# EAGLE design untitled (EAGLE 6.1)
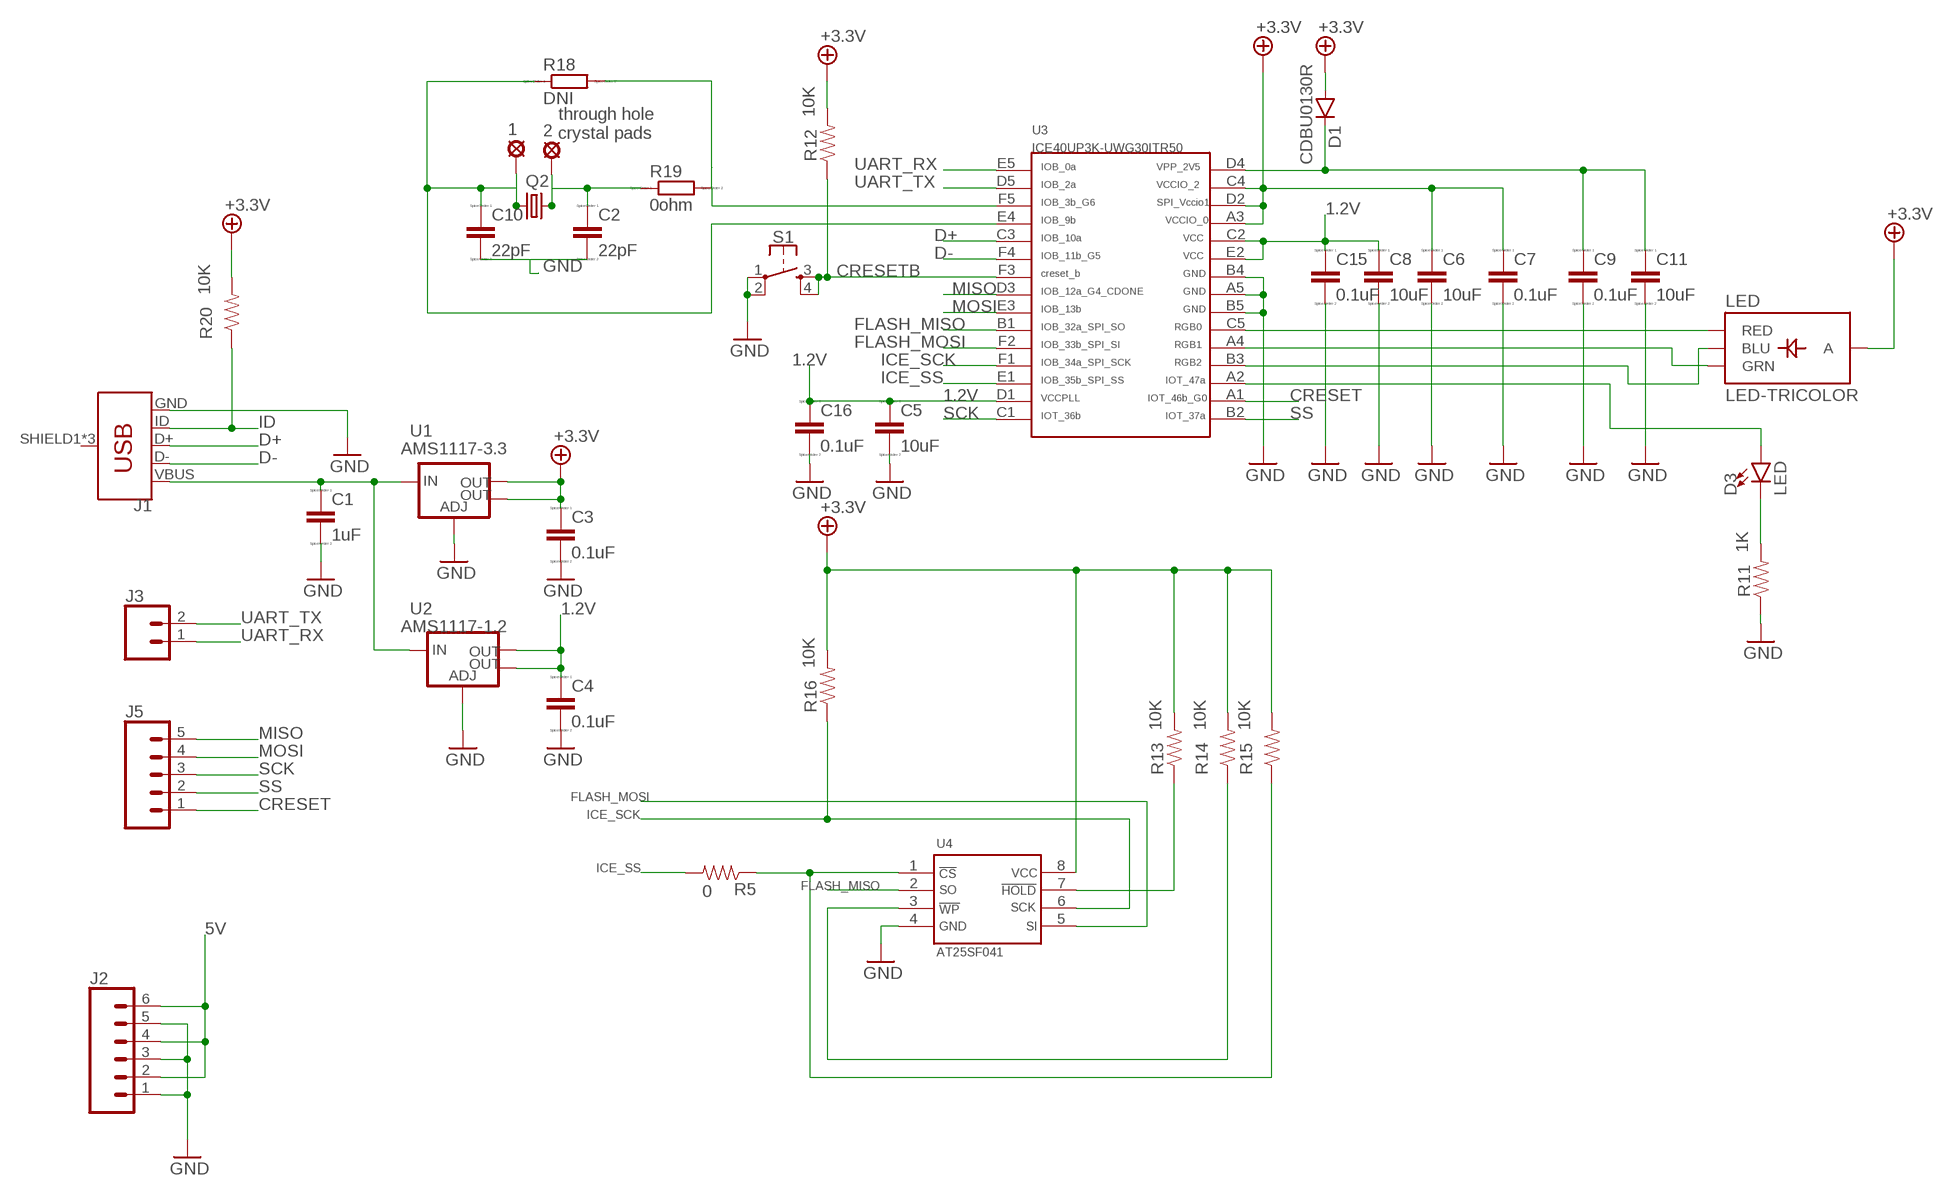
[diagram p0: schematic, sheet 1]

## Parts
1  LSP10  [LSP10]
2  LSP10  [LSP10]
C1  1uF  CC0402  [C0402]
C2  22pF  CC0402  [C0402]
C3  0.1uF  CC0402  [C0402]
C4  0.1uF  CC0402  [C0402]
C5  10uF  CC0402  [C0402]
C6  10uF  CC0402  [C0402]
C7  0.1uF  CC0402  [C0402]
C8  10uF  CC0402  [C0402]
C9  0.1uF  CC0402  [C0402]
C10  22pF  CC0402  [C0402]
C11  10uF  CC0402  [C0402]
C15  0.1uF  CC0402  [C0402]
C16  0.1uF  CC0402  [C0402]
D1  CDBU0130R  DIODE1  [SOD523]
D3  LED  LED0603  [LED-0603]
J1  USB_MICRO-B_FEMALE-SMT  [USB-B-MICRO-SMD]
J2  CONN_06NO_SILK_FEMALE_PTH  [1X06_NO_SILK]
J3  CONN_02  [1X02]
J5  CONN_05  [1X05]
LED  LED-TRICOLOR  [LED-TRICOLOR-SMD]
Q2  CRYSTALHC49UP  [HC49UP]
R5  0  RESISTOR0805-RES  [0805]
R11  1K  RESISTOR0603  [0603-RES]
R12  10K  RESISTOR0603  [0603-RES]
R13  10K  RESISTOR0603-RES  [0603-RES]
R14  10K  RESISTOR0603-RES  [0603-RES]
R15  10K  RESISTOR0603-RES  [0603-RES]
R16  10K  RESISTOR0603-RES  [0603-RES]
R18  DNI  RR0402  [R0402]
R19  0ohm  RR0402  [R0402]
R20  10K  RESISTOR0603  [0603-RES]
S1  MOMENTARY-SWITCH-SPST-2-SMD-4.6X2.8MM  [TACTILE_SWITCH_SMD_4.6X2.8MM]
U1  AMS1117-3.3  V_REG_LM1117SOT223  [SOT223]
U2  AMS1117-1.2  V_REG_LM1117SOT223  [SOT223]
U3  ICE40UP3K-UWG30ITR50  [WLSC-30]
U4  AT25SF041  [SO8]

## Nets
1.2V: C4.1 C5.1 C8.1 C15.1 C16.1 U2.2(OUT) U2.4(OUT) U3.C2 U3.D1 U3.E2
5: 1.MP C10.1 Q2.1 R18.1 U3.E4
5V: C1.1 J1.VBUS J2.2 J2.4 J2.6 U1.3(IN) U2.3(IN)
6: R18.2 R19.2 U3.F5
+3.3V: C3.1 C6.1 C7.1 D1.A LED.A R12.2 R13.2 R14.2 R15.2 R16.2 R20.2 U1.2(OUT) U1.4(OUT) U3.A3 U3.C4 U3.D2 U4.8
CRESET: J5.1 U3.A1
CRESETB: R12.1 S1.3 S1.4 U3.F3
D+: J1.D+ U3.C3
D-: J1.D- U3.F4
FLASH_MISO: U3.B1 U4.2
FLASH_MOSI: U3.F2 U4.5
GND: C1.2 C2.2 C3.2 C4.2 C5.2 C6.2 C7.2 C8.2 C9.2 C10.2 C11.2 C15.2 C16.2 J1.GND J2.1 J2.3 J2.5 R11.1 S1.1 S1.2 U1.1(ADJ) U2.1(ADJ) U3.A5 U3.B4 U3.B5 U4.4
ICE_SCK: R16.1 U3.F1 U4.6
ICE_SS: R5.2 U3.E1
ID: J1.ID R20.1
MISO: J5.5 U3.D3
MOSI: J5.4 U3.E3
N$4: R13.1 U4.7
N$6: R14.1 U4.3
N$7: R5.1 R15.1 U4.1
N$9: LED.R(RED) U3.C5
N$10: LED.G(GRN) U3.A4
N$11: LED.B(BLU) U3.B3
N$12: D3.A U3.A2
N$13: D3.C R11.2
N$18: C9.1 C11.1 D1.C U3.D4
N$24: 2.MP C2.1 Q2.2 R19.1
SCK: J5.3 U3.C1
SS: J5.2 U3.B2
UART_RX: J3.1 U3.E5
UART_TX: J3.2 U3.D5
Unconnected: J1.SHIELD1(SHIELD) J1.SHIELD2(SHIELD) J1.SHIELD3(SHIELD)

## Notes on the sheet
- through hole
   crystal pads

## Library data of the parts
1 2 = solpad:LSP10: SOLDER PAD drill 1.0 mm, distributor Buerklin, 12H555
C1-C11 C15 C16 = eagle-ltspice:C: CAPACITOR, European symbol; SPICEMODEL: NONE; SPICEPREFIX: C
D1 = CDBU0130R:DIODE1
D3 = SparkFun-LED:LED: LED (Generic) Standard schematic elements and footprints for 5mm, 3mm, 1206, and 0603 sized LEDs. Generic LEDs with no color specified.
J1 = MICRO USB 105164-0001:USB_MICRO-B: USB Type Micro-B Connector Male/female and PTH/SMT variants SparkFun Products: SparkFun microB USB Breakout <https://www.sparkfun.com/products/12035> SparkFun USB microB Plug Breakout <https://www.sparkfun.com/products/10031> SparkFun ESP8266 Thing <https://www.sparkfun.com/products/13231>; PROD_ID: CONN-11752
J2 = SparkFun-Connectors:CONN_06: Multi connection point. Often used as Generic Header-pin footprint for 0.1 inch spaced/style header connections On any of the 0.1 inch spaced packages, you can populate with these: Break Away Headers - Straight <https://www.sparkfun.com/products/116> (PRT-00116) Break Away Male Headers - Right Angle <https://www.sparkfun.com/products/553> (PRT-00553) Female Headers <https://www.sparkfun.com/products/115> (PRT-00115) Break Away Headers - Machine Pin <https://www.sparkfun.com/products/117> (PRT-00117) Break Away Female Headers - Swiss Machine Pin <https://www.sparkfun.com/products/743> (PRT-00743) Arduino Stackable Header - 6 Pin <https://www.sparkfun.com/products/9280> (PRT-09280) For SCREWTERMINALS and SPRING TERMINALS visit here: Screw Terimnals on SparkFun.com <https://www.sparkfun.com/search/results?term=Screw+Terminals> (5mm/3.5mm/2.54mm spacing) This device is also useful as a general connection point to wire up your design to another part of your project. Our various solder wires solder well into these plated through hole pads. Hook-Up Wire - Assortment (Stranded, 22 AWG) <https://www.sparkfun.com/products/11375> (PRT-11375) Hook-Up Wire - Assortment (Solid Core, 22 AWG) <https://www.sparkfun.com/products/11367> (PRT-11367) View the entire wire category on our website here <https://www.sparkfun.com/categories/141>; PROD_ID: CONN-08437
J3 = SparkFun-Connectors:CONN_02: Multi connection point. Often used as Generic Header-pin footprint for 0.1 inch spaced/style header connections On any of the 0.1 inch spaced packages, you can populate with these: Break Away Headers - Straight <https://www.sparkfun.com/products/116> (PRT-00116) Break Away Male Headers - Right Angle <https://www.sparkfun.com/products/553> (PRT-00553) Female Headers <https://www.sparkfun.com/products/115> (PRT-00115) Break Away Headers - Machine Pin <https://www.sparkfun.com/products/117> (PRT-00117) Break Away Female Headers - Swiss Machine Pin <https://www.sparkfun.com/products/743> (PRT-00743) For SCREWTERMINALS and SPRING TERMINALS visit here: Screw Terimnals on SparkFun.com <https://www.sparkfun.com/search/results?term=Screw+Terminals> (5mm/3.5mm/2.54mm spacing) This device is also useful as a general connection point to wire up your design to another part of your project. Our various solder wires solder well into these plated through hole pads. Hook-Up Wire - Assortment (Stranded, 22 AWG) <https://www.sparkfun.com/products/11375> (PRT-11375) Hook-Up Wire - Assortment (Solid Core, 22 AWG) <https://www.sparkfun.com/products/11367> (PRT-11367) View the entire wire category on our website here <https://www.sparkfun.com/categories/141> Special notes: Molex polarized connector foot print use with: PRT-08233 with associated crimp pins and housings. 2.54_SCREWTERM for use with PRT-10571. 3.5mm Screw Terminal footprints for PRT-08084 5mm Screw Terminal footprints for use with PRT-08432
J5 = SparkFun-Connectors:CONN_05: Multi connection point. Often used as Generic Header-pin footprint for 0.1 inch spaced/style header connections On any of the 0.1 inch spaced packages, you can populate with these: Break Away Headers - Straight <https://www.sparkfun.com/products/116> (PRT-00116) Break Away Male Headers - Right Angle <https://www.sparkfun.com/products/553> (PRT-00553) Female Headers <https://www.sparkfun.com/products/115> (PRT-00115) Break Away Headers - Machine Pin <https://www.sparkfun.com/products/117> (PRT-00117) Break Away Female Headers - Swiss Machine Pin <https://www.sparkfun.com/products/743> (PRT-00743) For SCREWTERMINALS and SPRING TERMINALS visit here: Screw Terimnals on SparkFun.com <https://www.sparkfun.com/search/results?term=Screw+Terminals> (5mm/3.5mm/2.54mm spacing) This device is also useful as a general connection point to wire up your design to another part of your project. Our various solder wires solder well into these plated through hole pads. Hook-Up Wire - Assortment (Stranded, 22 AWG) <https://www.sparkfun.com/products/11375> (PRT-11375) Hook-Up Wire - Assortment (Solid Core, 22 AWG) <https://www.sparkfun.com/products/11367> (PRT-11367) View the entire wire category on our website here <https://www.sparkfun.com/categories/141> Special notes: Molex polarized connector foot print use with SKU : PRT-08231 with associated crimp pins and housings. 1MM SMD Version SKU: PRT-10208
LED = SparkFun-LED:LED-TRICOLOR: Tri-Color LED SMD Proven layout and schematic for triple color LED in SMD package - common anode. Spark Fun Electronics SKU : COM-07844
Q2 = crystal:CRYSTAL: CRYSTAL; OC_FARNELL: unknown; OC_NEWARK: unknown
R5 R11-R16 R20 = SparkFun-Resistors:RESISTOR: Resistor Basic schematic elements and footprints for 0603, 1206, and PTH resistors.
R18 R19 = eagle-ltspice:R: RESISTOR, European symbol; SPICEMODEL: NONE; SPICEPREFIX: R
S1 = SparkFun-Switches:MOMENTARY-SWITCH-SPST-2: Momentary Switch (Pushbutton) - SPST - Two Circuits Normally-open (NO) SPST momentary switches (buttons, pushbuttons). Schematic symbol includes two switch circuits. Variants SMD-4.6MMX2.8MM - 4.60mm x 2.80mm Tactile Momentary Button Switch - Used on SparkFun SAMD21 Mini Breakout <https://www.sparkfun.com/products/13664> SMD-5.2MM - Mini Pushbutton Switch - SMD <https://www.sparkfun.com/products/8720> - Used on Arduino Pro Mini <https://www.sparkfun.com/products/11114>; PROD_ID: SWCH-13065
U1 U2 = SparkFun-IC-Power:V_REG_LM1117: Voltage Regulator LM1117 Standard adjustable voltage regulator but in SMD form. Spark Fun Electronics SKU : COM-00595; PROD_ID: VREG-08170
U3 = ICE40UP3K:ICE40UP3K-UWG30ITR50
U4 = AT25SF041:AT25SF041

## Net classes
0 default: width 0.1 mm, drill 0.305 mm

## Board
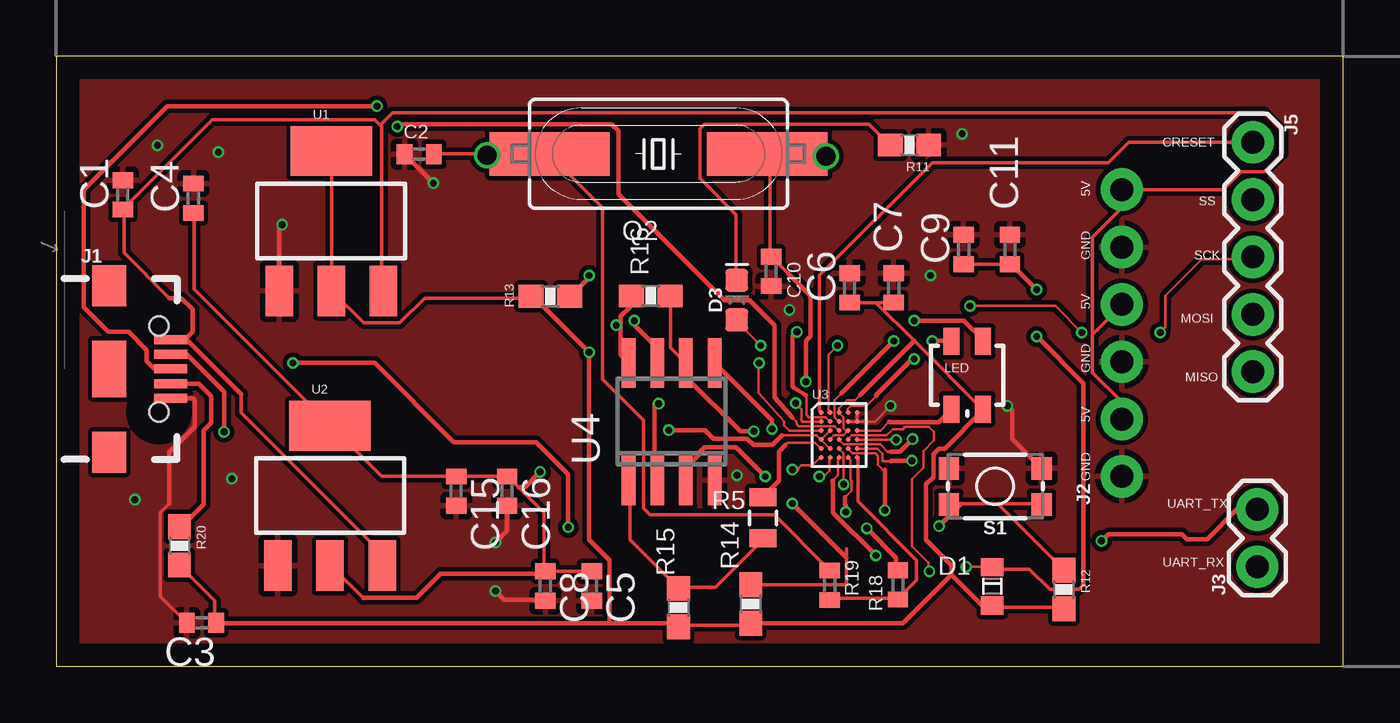
[diagram p1: board, top side]
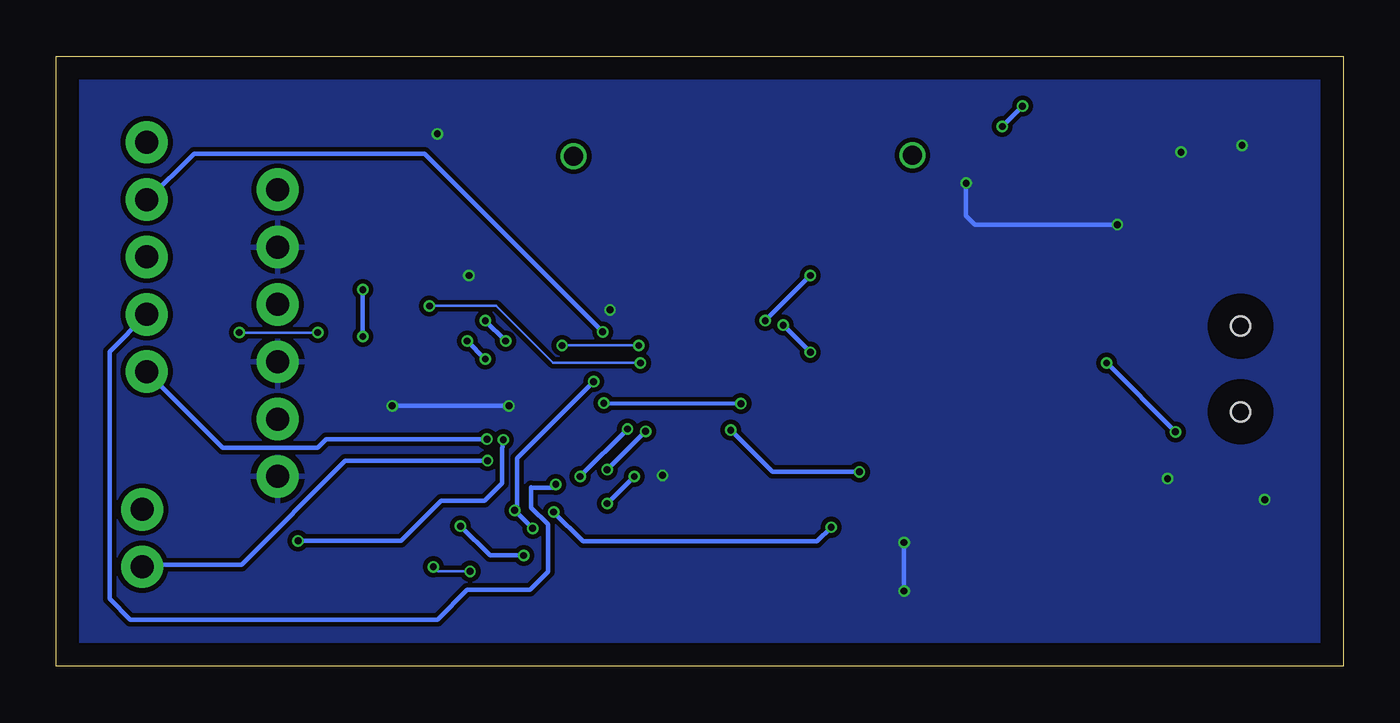
[diagram p2: board, bottom side, seen from below]

Size 57 x 27 mm. Coordinates in mm from the lower left corner, seen from the top.
Outline: 0,0 57,0 57,27 0,27 0,0
Copper layers (1*16): Top 0.035mm / dielectric 1.5mm / Bottom 0.035mm
Design rules: minimum track width 0.1mm, minimum drill 12mil, track to track 8mil, track to pad 8mil, pad to pad 8mil, via to via 8mil, smd to smd 8mil, copper to edge 40mil, drill to drill 8mil, minimum pad ring 5mil, minimum via ring 4mil, stop-mask expansion 4mil, vias tented up to drill 0mil, thermal gap 10mil

### Footprints (pad centres in the part's own frame; a part is rotated, then mirrored left to right if it is on the bottom)
LSP10 = drill 0.85: MP 0,0
C0402 = smd 0.7 x 0.9: 1 -0.65,0; 2 0.65,0
SOD523 = smd 0.8 x 1: A 1.1,0; C -0.6,0
LED-0603 = smd 1 x 1: A -0.877,0; C 0.877,0
USB-B-MICRO-SMD = smd 1.45 x 0.4: D+ 2.725,0; D- 2.725,0.65; GND 2.725,-1.3; ID 2.725,-0.65; VBUS 2.725,1.3 | smd 1.5 x 1.8: SHIELD1 0,3.685; SHIELD2 0,-3.685 | smd 1.5 x 2.5: SHIELD3 0,0 | hole 0.85: 2.2,1.9; 2.2,-1.9
1X06_NO_SILK = drill 1.016 pad 1.88: 1 0,0; 2 2.54,0; 3 5.08,0; 4 7.62,0; 5 10.16,0; 6 12.7,0
1X02 = drill 1.016 pad 1.88: 1 0,0; 2 2.54,0
1X05 = drill 1.016 pad 1.88: 1 0,0; 2 2.54,0; 3 5.08,0; 4 7.62,0; 5 10.16,0
LED-TRICOLOR-SMD = smd 0.7 x 1.2: A 0.7,-1.5; B 0.7,1.5; G -0.7,1.5; R -0.7,-1.5
HC49UP = smd 5.334 x 1.93: 1 -4.826,0; 2 4.826,0
0805 = smd 0.8 x 1.2: 1 -0.9,0; 2 0.9,0
0603-RES = smd 1.1 x 1: 1 -0.85,0; 2 0.85,0
R0402 = smd 0.7 x 0.9: 1 -0.65,0; 2 0.65,0
TACTILE_SWITCH_SMD_4.6X2.8MM = smd 0.9 x 1: 1 -2.05,-0.8; 2 2.05,-0.8; 3 2.05,0.8; 4 -2.05,0.8
SOT223 = smd 1.219 x 2.235: 1 -2.311,-3.099; 2 0,-3.099; 3 2.311,-3.099 | smd 3.6 x 2.2: 4 0,3.099
WLSC-30 = smd 0.22 x 0.22: A1 0,0; A2 0.4,0; A3 0.8,0; A4 1.2,0; A5 1.6,0; B1 0,-0.4; B2 0.4,-0.4; B3 0.8,-0.4; B4 1.2,-0.4; B5 1.6,-0.4; C1 0,-0.8; C2 0.4,-0.8; C3 0.8,-0.8; C4 1.2,-0.8; C5 1.6,-0.8; D1 0,-1.2; D2 0.4,-1.2; D3 0.8,-1.2; D4 1.2,-1.2; D5 1.6,-1.2; E1 0,-1.6; E2 0.4,-1.6; E3 0.8,-1.6; E4 1.2,-1.6; E5 1.6,-1.6; F1 0,-2; F2 0.4,-2; F3 0.8,-2; F4 1.2,-2; F5 1.6,-2
SO8 = smd 0.6 x 2.2: 1 -1.905,-2.6; 2 -0.635,-2.6; 3 0.635,-2.6; 4 1.905,-2.6; 5 1.905,2.6; 6 0.635,2.6; 7 -0.635,2.6; 8 -1.905,2.6

### Placement (x,y rotation side)
1  34.08,22.57 0 top
2  19.08,22.62 0 top
C1  2.94,20.87 90 top
C2  16.07,22.67 180 top
C3  6.43,1.92 180 top
C4  6.07,20.72 90 top
C5  23.71,3.55 270 top
C6  35.14,16.75 90 top
C7  37.09,16.75 90 top
C8  21.66,3.55 270 top
C9  40.19,18.45 90 top
C10  31.66,17.48 270 top
C11  42.24,18.45 90 top
C15  17.71,7.75 270 top
C16  19.96,7.75 270 top
D1  41.46,3.79 270 top
D3  30.14,16.21 90 top
J1  2.34,13.16 0 top
J2  47.2,8.4 90 top
J3  53.2,4.4 90 top
J5  53,23.2 270 top
LED  40.35,12.88 0 top
Q2  26.67,22.69 180 top
R5  31.3,6.57 90 top
R11  37.79,23.08 180 top
R12  44.63,3.39 270 top
R13  21.88,16.38 180 top
R14  30.75,2.75 270 top
R15  27.56,2.59 270 top
R16  26.33,16.4 180 top
R18  37.28,3.6 270 top
R19  34.26,3.58 270 top
R20  5.45,5.33 270 top
S1  41.59,7.96 180 top
U1  12.18,19.72 0 top
U2  12.12,7.55 0 top
U3  33.87,11.23 0 top
U4  27.25,10.83 0 top

### Tracks (layer width: path | path; a pad name or v marks a point on that pad's centre or on a via)
1.2V  (via drill 0.3)
  Top 0.1: U3.C2 U3.D1 | U3.D1 33.67,10.22 32.15,10.22 | U3.E2 U3.D1
  Top 0.15: C5.1 C8.1 21.6,4.2 21.6,6.8 20.48,7.92 20,8.4 C16.1 C15.1 14.4,8.4 12.2,10.6 U2.4 12.1,10.7 6.1,16.7 6.1,20 C4.1 | 13.6,3 12.2,4.4 U2.2
  Top 0.2: 21.6,4.2 21.5,4.1 17.02,4.1 15.95,3.02 13.6,3.02 13.6,3 | 32.15,10.22 31.73,9.8 30.88,9.8 30.6,10.07 29.1,10.07 28.73,10.45 v27.12,10.45 | v21.43,8.6 20.75,7.92 20.48,7.92
  Bottom 0.2: v27.12,10.45 25.27,8.6 v21.43,8.6
5  (via drill 0.3)
  Top 0.1: U3.E4 35.27,9.43 36.27,9.43 36.4,9.3 36.4,8.93 36.62,8.7 36.7,8.7
  Top 0.15: 32.4,17.4 31.7,18.1 C10.1 31.6,18.2 31.6,22.5 31.5,22.6 Q2.1 31.6,22.6 34,22.6 1.MP
  Top 0.2: v35.9,6.1 37.2,4.8 37.2,4.3 R18.1 | 36.7,8.7 v36.7,6.9 | v33.2,12.6 33.2,14.4 33.4,14.6 33.4,16.4 32.4,17.4
  Bottom 0.2: v35.9,6.1 v36.7,6.9 36.6,6.9 36.6,9.2 v33.2,12.6
5V
  Top 0.15: J2.2 47.2,11.7 45.9,13 45.9,14.7 45.95,14.75 | 45.95,14.75 47.2,16 J2.4 | 45.95,14.75 45.9,14.8 45.9,19 47.2,20.3 J2.6 51.7,21.1 52.5,21.9 53.5,21.9 54.3,22.7 54.3,23.7 53.5,24.5 14.9,24.5 14.35,23.95 | 5,16.3 3,18.3 3,20.2 C1.1 3,20.3 6.9,24.2 14.1,24.2 14.35,23.95 | 5,14.5 J1.VBUS | 8.18,12.03 8.18,11.22 14.4,5 14.4,4.5 U2.3 | 14.35,23.95 14.4,23.9 14.4,16.7 U1.3
  Top 0.2: 5,14.5 5.72,14.5 | 5.72,14.5 8.18,12.05 8.18,12.03 | 5,16.3 5.53,16.3 6.03,15.8 6.03,14.8 5.72,14.5
6
  Top 0.15: U3.F5 35.5,9.2 35.5,7.3 38.1,4.7 38.1,3.8 37.3,3 R18.2 37.2,3 34.3,3 R19.2
+3.3V  (via drill 0.3)
  Top 0.1: U3.D2 34.27,10.04 34.45,10.22 34.87,10.22 U3.C4 34.97,10.43 34.88,10.53 34.88,11.03 U3.A3 34.67,11.43 35.02,11.78 35.38,11.78 35.6,12 35.65,12.05
  Top 0.15: R13.2 21,16.3 16.3,16.3 15.2,15.2 13.6,15.2 12.2,16.6 U1.2 12.2,16.7 12.2,22.8 U1.4 | C7.1 36.3,16.1 | 36.3,16.1 C6.1 | 36.3,16.1 38,14.4 41,11.4 LED.A | C3.1 7,2 7,2.9 5.5,4.4 R20.2 | R15.2 27.6,1.8 30.6,1.8 30.7,1.9 R14.2 | D1.A 41.1,2.6 44.6,2.6 R12.2
  Top 0.2: 25,15.1 25,13.8 25.3,13.5 U4.8 | 25,15.1 25,15.5 25.4,15.9 25.4,16.4 R16.2 | v24.8,15.1 25,15.1 | R13.2 21.1,16.4 v23.6,13.9 23.6,5.6 24.5,4.7 24.5,1.9 | 38,14.4 35.6,12 | 39.65,4.05 41,2.7 D1.A | 41,11.3 LED.A 41.02,11.36 41.02,11.3 39.35,9.62 39.1,9.62 38.85,9.38 38.85,8.38 38.52,8.05 38.52,5.6 39.65,4.47 39.65,4.05 | R14.2 37.5,1.9 39.65,4.05 | 24.5,1.9 27.4,1.9 R15.2 | 24.5,1.9 7.1,1.9 C3.1
  Bottom 0.2: v23.6,13.9 v24.8,15.1
CRESET
  Top 0.15: J5.1 47.5,23.2 46.6,22.3 38.8,22.3 33.8,17.3 33.8,11.3 U3.A1
CRESETB  (via drill 0.3)
  Top 0.1: U3.F3 34.62,9.19 34.62,8.45 34.39,8.21 34.33,8.15
  Top 0.15: 41.7,7.2 43.6,7.2 S1.4 | 41.7,7.2 40.1,7.2 39.6,7.2 S1.3 | 41.7,7.2 44.6,4.3 R12.1
  Top 0.2: v36.3,4.9 34.4,6.8 34.4,8.2 34.39,8.21 | 40.1,7.2 v39.1,6.2
  Bottom 0.2: v36.3,4.9 37.8,4.9 v39.1,6.2
D+  (via drill 0.3)
  Top 0.1: U3.C3 34.48,10.62 32.88,10.62 32.77,10.72 32.77,10.82 32.6,11
  Top 0.2: 32.6,11 31.8,11.9 31.8,15.1 30.7,16.2 29.6,16.2 24.9,20.9 24.9,23.7 24.6,24 15.2,24 v15.1,23.9 | v14.2,24.8 4.9,24.8 1.2,21.1 1.2,15.9 2.3,14.8 3.2,14.8 4,14 4,13.5 4.3,13.2 5,13.2 J1.D+
  Bottom 0.2: v14.2,24.8 v15.1,23.9
D-  (via drill 0.3)
  Top 0.1: U3.F4 35.17,9.12 35.17,8.25 35.23,8.2 35.23,7.78 34.92,7.47
  Top 0.2: J1.D- 5.76,13.81 7.42,12.15 v7.42,10.38 | v10.47,13.43 14.1,13.43 17.6,9.93 21.25,9.93 22.68,8.5 v22.68,6.15 | v34.98,6.83 34.98,7.12 34.92,7.17 34.92,7.47
  Bottom 0.2: v7.42,10.38 v10.47,13.43 | v22.68,6.15 23.3,5.53 33.67,5.53 v34.98,6.83
FLASH_MISO  (via drill 0.3)
  Top 0.1: U3.B1 33.05,10.82 33,10.88 33,11.38 v32.75,11.65
  Top 0.2: U4.2 26.5,8.35 26.5,11.65 v26.68,11.62
  Bottom 0.2: v26.68,11.62 v32.75,11.65
FLASH_MOSI  (via drill 0.3)
  Top 0.1: U3.F2 34.25,9.21 34.25,8.65 34.02,8.43 33.85,8.43 33.81,8.39 33.7,8.28
  Top 0.2: v31.7,10.5 31.7,10.9 29.2,13.4 U4.5 | v33.8,8.4 33.81,8.39
  Bottom 0.2: v31.7,10.5 v33.8,8.4
GND  (via drill 0.3)
  Top 0.1: U3.B4 U3.B5 | U3.B5 U3.A5 | U3.B5 36.26,10.83 v36.95,11.53
  Top 0.15: 5,7.2 4.6,6.8 4.6,3.1 C3.2 | 5,11.8 J1.GND
  Top 0.2: C2.2 v16.7,21.39 | v10,19.55 9.87,19.42 U1.1 | C8.2 21.61,2.95 19.82,2.95 v19.45,3.33 | v19.45,5.47 19.96,5.99 C16.2 | v42.12,11.53 42.35,11.3 42.35,10.05 S1.1 | 5,7.2 5,9.47 6.12,10.6 6.12,11.78 6.04,11.86 J1.GND
  Bottom 0.2: v16.7,21.39 16.7,19.95 16.3,19.55 v10,19.55 | v19.45,3.33 v19.45,5.47 | v36.95,11.53 v42.12,11.53
  other vias: 3.48,7.38 7.78,8.3 30.15,8.45 32.48,15.78 38.73,17.3 40.12,23.57 4.47,23.06 7.17,22.76
  pour Top (isolate 0.12): 0,27 57,27 57,0 0,0
  pour Bottom (isolate 0.12): 0,27 57,27 57,0 0,0
ICE_SCK  (via drill 0.3)
  Top 0.1: U3.F1 33.83,9.23 33.5,8.9 33,8.9 32.8,8.7 32.75,8.65
  Top 0.15: R16.1 27.2,16.4 27.2,14.1 27.8,13.5 U4.6
  Top 0.2: v32.6,8.7 32.8,8.7 | v30.9,10.4 30.3,10.4 27.9,12.8 27.9,13.4 U4.6
  Bottom 0.2: v30.9,10.4 v32.6,8.7
ICE_SS
  Top 0.1: U3.E1 33.6,9.9 32.4,9.9 32.3,9.8 32.27,9.78
  Top 0.2: 32.3,9.8 32,9.5 32,8.2 31.3,7.5 R5.2
ID
  Top 0.15: 5.8,12.5 5.1,12.5 J1.ID | 5.5,6.2 R20.1
  Top 0.2: 5.8,12.5 6.3,12.5 6.85,11.95 6.85,10.78 6.53,10.45 6.53,7.17 5.5,6.15 5.48,6.15 R20.1
MISO  (via drill 0.3)
  Top 0.1: U3.D3 34.88,9.82 36.5,9.82 36.83,9.5 36.95,9.5
  Top 0.2: v37.92,10.05 37.38,9.5 36.95,9.5
  Bottom 0.2: J5.5 49.63,9.68 45.42,9.68 45.05,10.05 v37.92,10.05
MOSI  (via drill 0.3)
  Top 0.1: U3.E3 34.88,9.43 34.88,8.15 34.92,8.1
  Top 0.2: 34.92,8.1 v34.88,8.05
  Bottom 0.2: J5.4 54.65,13.93 54.65,2.98 53.73,2.05 40.12,2.05 38.8,3.38 36.02,3.38 35.23,4.17 35.23,6.28 35.98,7.03 35.98,7.92 35.95,7.9 34.88,7.9 | v34.88,8.05 34.88,7.9 | 34.88,7.9 34.83,7.9
N$4  (via drill 0.3)
  Top 0.2: v23.6,17.3 23.6,17.2 22.8,16.4 R13.1 | v25.6,15.3 25.6,15.1 26.6,14.1 26.6,13.5 U4.7
  Bottom 0.2: v25.6,15.3 v23.6,17.3
N$6  (via drill 0.3)
  Top 0.15: R14.1 34.9,3.6 35,3.7 35,4.8 35,5.2 | 27.9,8.8 27.9,8.3 U4.3
  Top 0.2: v31.4,8.4 30.1,9.7 28.7,9.7 28.5,9.5 28.5,9.4 27.9,8.8 U4.3 | 35,4.8 v32.6,7.2
  Bottom 0.2: v32.6,7.2 v31.4,8.4
N$7
  Top 0.15: R5.1 31.3,5.6 29.2,3.5 27.6,3.5 R15.1 25.4,5.6 25.4,8.2 U4.1
N$9
  Top 0.1: U3.C5 36.51,10.43 36.89,10.81 36.95,10.88
  Top 0.2: 36.89,10.81 36.9,10.8 39.1,10.8 39.6,11.3 LED.R
N$10  (via drill 0.3)
  Top 0.1: U3.A4 35.05,11.25 35.05,11.38 35.2,11.53 35.88,11.53 36.33,11.97 36.35,12
  Top 0.2: v38,13.6 37.9,13.6 36.3,12 36.33,11.97 | v38.8,14.4 39.6,14.4 LED.G
  Bottom 0.2: v38.8,14.4 v38,13.6
N$11  (via drill 0.3)
  Top 0.1: U3.B3 34.48,11.03 34.48,11.78 34.77,12.07
  Top 0.2: v37.1,14.4 34.77,12.07 | v38,15.3 40.2,15.3 41.1,14.4 LED.B
  Bottom 0.2: v38,15.3 v37.1,14.4
N$12  (via drill 0.3)
  Top 0.1: U3.A2 34.2,11.23 34.2,13.8 v34.6,14.2 | v31.2,14.2 30.2,15.2 30.2,15.27 D3.A
  Bottom 0.1: v34.6,14.2 v31.2,14.2
N$13
  Top 0.15: D3.C 30.1,17.1 30.1,20 28.5,21.6 28.5,23.8 28.7,24 36,24 36.9,23.1 R11.2
N$18  (via drill 0.3)
  Top 0.1: U3.D4 35.07,10.04 35.25,10.22 36.77,10.22 37.05,10.5 37.5,10.5 37.6,10.6 38.65,10.6 38.88,10.38 38.88,10 38.4,9.53 38.4,8.78 37.9,8.28 37.9,5.3 38.62,4.58 38.62,4.25 v38.67,4.2 | v40.3,4.4 40.97,4.4 D1.C
  Top 0.15: C9.1 C11.1 42.3,17.8 | 45.5,3.6 45.3,3.4 44,3.4 43.1,4.3 41.1,4.3 D1.C
  Top 0.2: 42.3,17.8 v43.42,16.68 | v43.42,14.6 45.5,12.53 45.5,3.6
  Bottom 0.1: v38.67,4.2 40.1,4.2 v40.3,4.4
  Bottom 0.2: v43.42,16.68 v43.42,14.6
N$24
  Top 0.15: C2.1 16.8,22.7 19,22.7 2.MP 19.1,22.6 21.8,22.6 Q2.2 21.9,22.6 24.2,20.3 24.2,12.7 26,10.9 26,7 26.3,6.7 31.8,6.7 34.2,4.3 R19.1
SCK  (via drill 0.3)
  Top 0.1: U3.C1 32.48,10.43 32.23,10.68 32.23,10.85 31.1,12.1 31.1,13.4 v31.12,13.43 | J5.3 53,18.02 50.75,18.02 49.12,16.4 49.12,15 v48.9,14.78 | v45.42,14.78 44.25,15.95 v40.48,15.95 40.45,15.95
  Bottom 0.1: v31.12,13.43 35,13.43 37.52,15.95 v40.48,15.95 | v48.9,14.78 v45.42,14.78
SS  (via drill 0.3)
  Top 0.1: U3.B2 34.08,11.03 33.33,11.03 33.23,11.12 33.23,11.95 33.19,11.99 33.15,12.03
  Top 0.2: v32.8,14.8 32.6,14.6 32.6,12.4 32.67,12.32 33.2,12 33.19,11.99
  Bottom 0.2: v32.8,14.8 40.7,22.7 50.9,22.7 53,20.6 J5.2
UART_RX  (via drill 0.3)
  Top 0.1: U3.E5 36.38,9.62 36.6,9.4 36.6,9.1 36.62,9.07 36.98,9.07
  Top 0.2: v37.9,9.1 37,9.1 36.98,9.07
  Bottom 0.2: v37.9,9.1 44.2,9.1 48.8,4.5 53.1,4.5 J3.1
UART_TX  (via drill 0.3)
  Top 0.1: U3.D5 36.82,10.03 v37.2,10.03
  Top 0.2: J3.2 52.3,6.95 50.98,5.62 50.08,5.62 49.85,5.85 46.6,5.85 v46.3,5.55
  Bottom 0.2: v37.2,10.03 37.25,9.6 37.25,8.1 38.02,7.33 39.95,7.33 41.73,5.55 v46.3,5.55

### Text on the board
tPlace: CRESET | 5V | SS | GND | SCK | 5V | MOSI | GND | MISO | 5V | GND | UART_TX | UART_RX